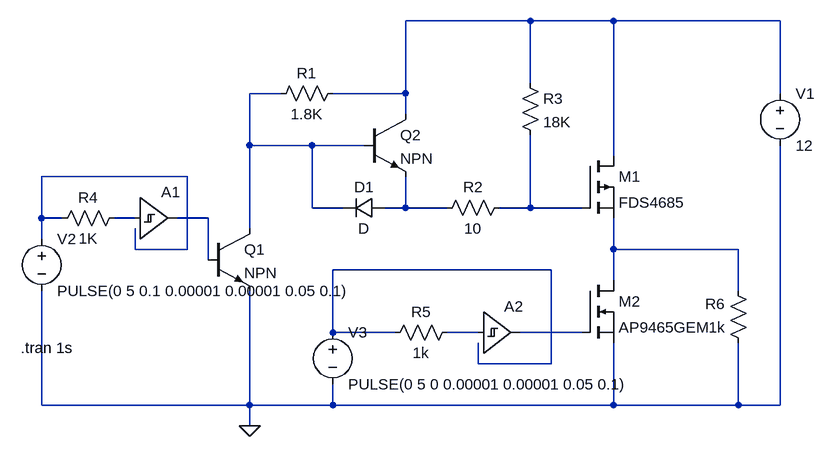
[diagram p0: schematic MK2.0.asc]
MK2.0.asc, the LTspice schematic file:
Version 4
SHEET 1 904 680
WIRE 464 -128 272 -128
WIRE 592 -128 464 -128
WIRE 848 -128 592 -128
WIRE 464 -32 464 -128
WIRE 80 -16 32 -16
WIRE 272 -16 272 -128
WIRE 272 -16 160 -16
WIRE 848 -16 848 -128
WIRE 272 16 272 -16
WIRE 32 64 32 -16
WIRE 128 64 32 64
WIRE 208 64 128 64
WIRE 592 80 592 -128
WIRE -64 112 -288 112
WIRE 128 160 128 64
WIRE 176 160 128 160
WIRE 272 160 272 112
WIRE 272 160 240 160
WIRE 336 160 272 160
WIRE 464 160 464 48
WIRE 464 160 416 160
WIRE 544 160 464 160
WIRE -288 176 -288 112
WIRE -256 176 -288 176
WIRE -144 176 -176 176
WIRE -32 176 -80 176
WIRE 32 192 32 64
WIRE -288 208 -288 176
WIRE -144 224 -144 192
WIRE -64 224 -64 112
WIRE -64 224 -144 224
WIRE 592 224 592 176
WIRE 784 224 592 224
WIRE -32 240 -32 176
WIRE 496 256 160 256
WIRE 592 272 592 224
WIRE 784 288 784 224
WIRE 160 352 160 256
WIRE 256 352 160 352
WIRE 384 352 336 352
WIRE 544 352 448 352
WIRE 384 400 384 368
WIRE 496 400 496 256
WIRE 496 400 384 400
WIRE -288 464 -288 288
WIRE 32 464 32 288
WIRE 32 464 -288 464
WIRE 160 464 160 432
WIRE 160 464 32 464
WIRE 592 464 592 368
WIRE 592 464 160 464
WIRE 784 464 784 368
WIRE 784 464 592 464
WIRE 848 464 848 64
WIRE 848 464 784 464
WIRE 32 496 32 464
FLAG 32 496 0
SYMBOL npn -32 192 R0
SYMATTR InstName Q1
SYMBOL npn 208 16 R0
SYMATTR InstName Q2
SYMBOL res 176 -32 R90
WINDOW 0 0 56 VBottom 2
WINDOW 3 32 56 VTop 2
SYMATTR InstName R1
SYMATTR Value 1.8K
SYMBOL voltage 848 -32 R0
WINDOW 123 0 0 Left 2
WINDOW 39 0 0 Left 2
SYMATTR InstName V1
SYMATTR Value 12
SYMBOL res 432 144 R90
WINDOW 0 0 56 VBottom 2
WINDOW 3 32 56 VTop 2
SYMATTR InstName R2
SYMATTR Value 10
SYMBOL res 448 -48 R0
SYMATTR InstName R3
SYMATTR Value 18K
SYMBOL pmos 544 80 R0
SYMATTR InstName M1
SYMATTR Value FDS4685
SYMBOL voltage -288 192 R0
WINDOW 123 0 0 Left 2
WINDOW 39 0 0 Left 2
SYMATTR InstName V2
SYMATTR Value PULSE(0 5 0.1 0.00001 0.00001 0.05 0.1)
SYMBOL diode 240 144 R90
WINDOW 0 0 32 VBottom 2
WINDOW 3 32 32 VTop 2
SYMATTR InstName D1
SYMBOL res -160 160 R90
WINDOW 0 0 56 VBottom 2
WINDOW 3 32 56 VTop 2
SYMATTR InstName R4
SYMATTR Value 1K
SYMBOL Digital\\schmtbuf -144 112 R0
SYMATTR InstName A1
SYMBOL nmos 544 272 R0
SYMATTR InstName M2
SYMATTR Value AP9465GEM
SYMBOL voltage 160 336 R0
WINDOW 123 0 0 Left 2
WINDOW 39 0 0 Left 2
SYMATTR InstName V3
SYMATTR Value PULSE(0 5 0 0.00001 0.00001 0.05 0.1)
SYMBOL res 352 336 R90
WINDOW 0 0 56 VBottom 2
WINDOW 3 32 56 VTop 2
SYMATTR InstName R5
SYMATTR Value 1k
SYMBOL Digital\\schmtbuf 384 288 R0
SYMATTR InstName A2
SYMBOL res 800 384 R180
WINDOW 0 36 76 Left 2
WINDOW 3 36 40 Left 2
SYMATTR InstName R6
SYMATTR Value 1k
TEXT -320 376 Left 2 !.tran 1s

The netlist it stands for:
* MK2.0.asc
Q1 N002 N007 0 0 NPN
Q2 N001 N002 N004 0 NPN
R1 N001 N002 1.8K
V1 N001 0 12
R2 N005 N004 10
R3 N001 N005 18K
M1 N001 N005 N008 N008 FDS4685
V2 N003 0 PULSE(0 5 0.1 0.00001 0.00001 0.05 0.1)
D1 N004 N002 D
R4 N006 N003 1K
A1 N006 N003 N003 N003 N003 N003 N007 N003 SCHMITT
M2 N008 N011 0 0 AP9465GEM
V3 N009 0 PULSE(0 5 0 0.00001 0.00001 0.05 0.1)
R5 N010 N009 1k
A2 N010 N009 N009 N009 N009 N009 N011 N009 SCHMITT
R6 0 N008 1k
.model D D
.lib standard.dio
.model NPN NPN
.model PNP PNP
.lib standard.bjt
.model NMOS NMOS
.model PMOS PMOS
.lib standard.mos
.tran 1s
.backanno
.end